# Altium project airbrakeController.PrjPcb
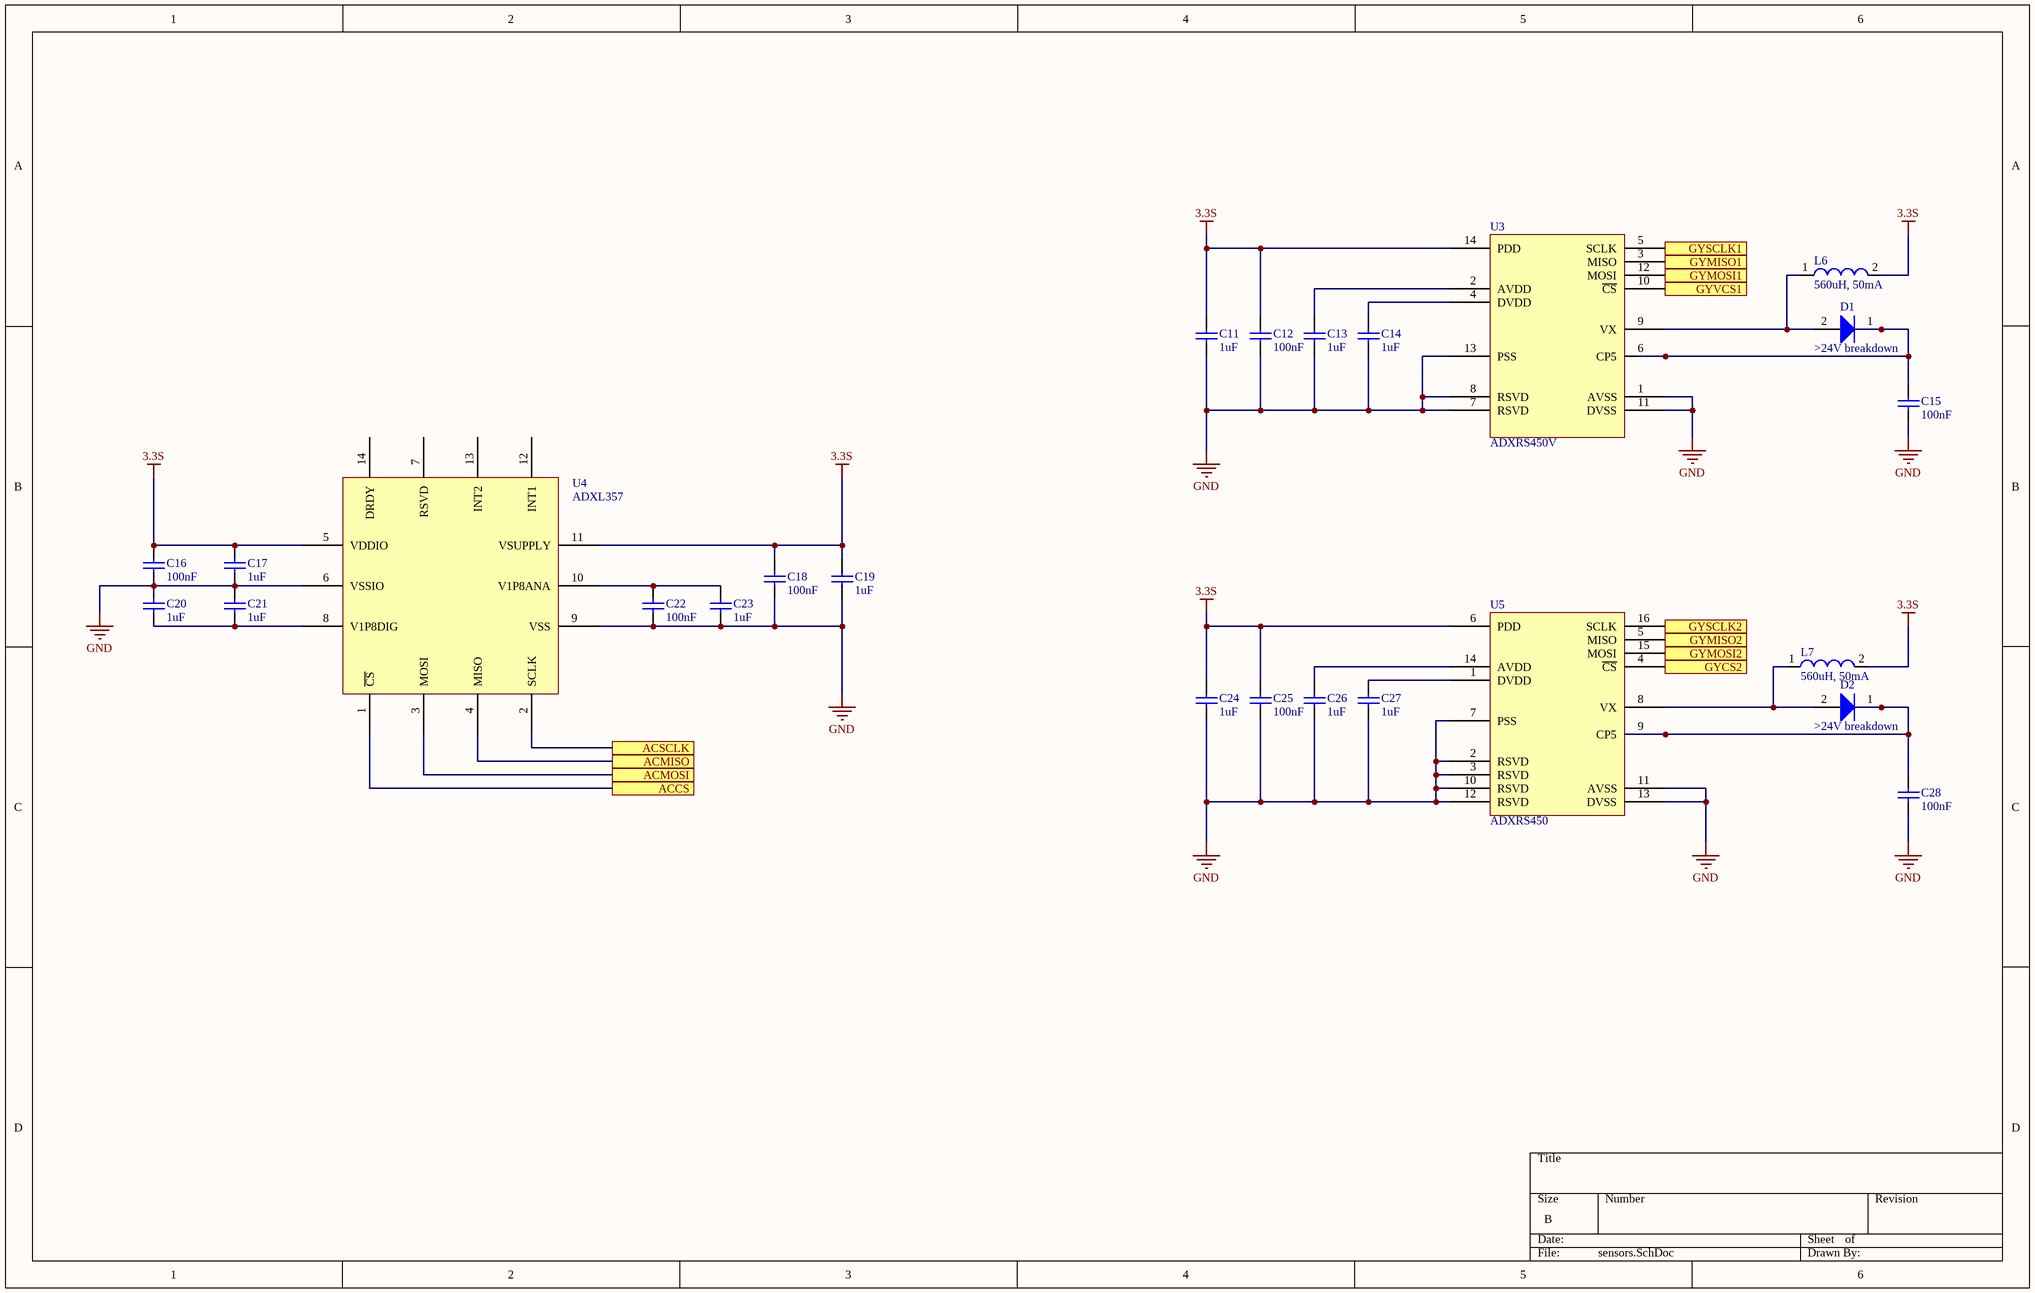
[diagram p0: sensors.SchDoc]
4 sheets, 70 parts. Net scope: flat (ports and power ports of the same name join across sheets).
Sheets:
  sensors.SchDoc
  SAMD21.SchDoc
  SAMD51.SchDoc
  peripherals.SchDoc

## Sheet sensors.SchDoc
size B

### Parts
C11  1uF  [CAPC1709X95X35LL10T25]
C12  100nF  [CAPC1608X90X40ML10T20]
C13  1uF  [CAPC1709X95X35LL10T25]
C14  1uF  [CAPC1709X95X35LL10T25]
C15  100nF  [CAPC1608X90X40ML10T20]
C16  100nF  [CAPC1608X90X40ML10T20]
C17  1uF  [CAPC1709X95X35LL10T25]
C18  100nF  [CAPC1608X90X40ML10T20]
C19  1uF  [CAPC1709X95X35LL10T25]
C20  1uF  [CAPC1709X95X35LL10T25]
C21  1uF  [CAPC1709X95X35LL10T25]
C22  100nF  [CAPC1608X90X40ML10T20]
C23  1uF  [CAPC1709X95X35LL10T25]
C24  1uF  [CAPC1709X95X35LL10T25]
C25  100nF  [CAPC1608X90X40ML10T20]
C26  1uF  [CAPC1709X95X35LL10T25]
C27  1uF  [CAPC1709X95X35LL10T25]
C28  100nF  [CAPC1608X90X40ML10T20]
D1  >24V breakdown  [ONSC-SOD-323-2-477-02_V]
D2  >24V breakdown  [ONSC-SOD-323-2-477-02_V]
L6  560uH, 50mA  [WE-PD-L]
L7  560uH, 50mA  [WE-PD-L]
U3  ADXRS450V  [LCC127P900X400X915-14N]
U4  ADXL357  [LCCS127P605X560X220-14N]
U5  ADXRS450  [SOIC127P1040X373-16N]

### Ports
ACCS, ACMISO, ACMOSI, ACSCLK, GYCS2, GYMISO1, GYMISO2, GYMOSI1, GYMOSI2, GYSCLK1, GYSCLK2, GYVCS1

### Nets
3.3S: C11.2 C12.2 C16.1 C17.2 C18.1 C19.2 C24.2 C25.2 L6.2 L7.2 U3.14(PDD) U4.5(VDDIO) U4.11(VSUPPLY) U5.6(PDD)
GND: C11.1 C12.1 C13.1 C14.1 C15.1 C16.2 C17.1 C18.2 C19.1 C20.2 C21.2 C22.2 C23.1 C24.1 C25.1 C26.1 C27.1 C28.1 U3.1(AVSS) U3.7(RSVD) U3.8(RSVD) U3.11(DVSS) U3.13(PSS) U4.6(VSSIO) U4.9(VSS) U5.2(RSVD) U5.3(RSVD) U5.7(PSS) U5.10(RSVD) U5.11(AVSS) U5.12(RSVD) U5.13(DVSS)
Net*_3: U4.2(SCLK) ; port ACSCLK
Net*_33: U4.3(MOSI) ; port ACMOSI
Net*_34: U4.4(MISO) ; port ACMISO
Net*_40: U5.16(SCLK) ; port GYSCLK2
Net*_41: U3.5(SCLK) ; port GYSCLK1
Net*_47: U3.3(MISO) ; port GYMISO1
Net*_48: U5.5(MISO) ; port GYMISO2
Net*_49: U3.12(MOSI) ; port GYMOSI1
Net*_50: U5.15(MOSI) ; port GYMOSI2
Net*_125: U5.4(~{CS}) ; port GYCS2
Net*_127: U4.1(~{CS}) ; port ACCS
NetC13_2: C13.2 U3.2(AVDD)
NetC14_2: C14.2 U3.4(DVDD)
NetC15_2: C15.2 D1.1(K) U3.6(CP5)
NetC20_1: C20.1 C21.1 U4.8(V1P8DIG)
NetC22_1: C22.1 C23.2 U4.10(V1P8ANA)
NetC26_2: C26.2 U5.14(AVDD)
NetC27_2: C27.2 U5.1(DVDD)
NetC28_2: C28.2 D2.1(K) U5.9(CP5)
NetD1_2: D1.2(A) L6.1 U3.9(VX)
NetD2_2: D2.2(A) L7.1 U5.8(VX)
NetU3_10: U3.10(~{CS}) ; port GYVCS1

Not connected (* = marked no-connect by the designer): U4 7(RSVD) 12(INT1) 13(INT2) 14(DRDY)

### Library data of the parts
C11 C13 C14 C17 C19-C21 C23 C24 C26 C27 = CMP-2000-07531-1: Chip Capacitor, 1 uF, +/- 10%, 50 V, -55 to 125 degC, 0603 (1608 Metric), RoHS, Tape and Reel; Manufacturer: Taiyo Yuden; Voltage Rating: 50V; Dielectric: X7R; Package Reference: 603; Thickness: 0.037inch; Capacitance: 1uF; Width: 0.031inch; Max Operating Temperature: 125degC; Mounting Technology: SurfaceMount; RoHSCompliant: True; Datasheet URL: http://ds.yuden.co.jp/TYCOMPAS/ut/detail.do?productNo=UMK107AB7105KA-T&fileName=UMK107AB7105KA-T_SS&mode=specSheetDownload; Length: 1.6mm; Radiation Hardening: No; Height: 0.8mm; Packaging: TapeandReel; Case/Package: 0603; Mount: SurfaceMount; Halogen Free: HalogenFree; Package Quantity: 1; Package Description: 2-Pin Surface Mount Device, Body 1.65 x 0.85 mm; Manufacturer URL: http://www.t-yuden.com/; Termination: SMD/SMT; Min Operating Temperature: -55degC; Tolerance: 10%; Case Code (Imperial): 0603; Voltage Rating (DC): 50V; Depth: 0.8mm; Datasheet Version: 09/2017; Case Code (Metric): 1608
C12 C15 C16 C18 C22 C25 C28 = CMP-2000-05002-1: Ceramic Multilayer Capacitor, 100 nF, +/- 10%, 50 V, -55 to 155 degC, 0603 (1608 Metric), RoHS, Tape and Reel; Manufacturer: Yageo; Online Catalog: CCSeries; Voltage - Rated: 16V; Product Training Modules: MultilayerCeramicCapacitors; Other Names: 311-1088-6; Featured Product: CommodityMultilayerCeramicCapacitors–CCSeries; Capacitance: 0.1µF; Temperature Coefficient: X7R; Height - Seated (Max): -; Operating Temperature: -55degC~125degC; Package / Case: 0603(1608Metric); Datasheet URL: https://datasheet.ciiva.com/11786/0900766b80d84f1d-11786077.pdf; Package Description: 2-Pin Surface Mount Device, Body 1.6 x 0.8 mm; Family: CeramicCapacitors; Packaging: Digi-Reel; Size / Dimension: 0.063"Lx0.031"W(1.60mmx0.80mm); Thickness (Max): 0.035"(0.90mm); Series: CC; Lead Spacing: -; Features: -; Tolerance: ±10%; Lead Style: -; Ratings: -; Manufacturer URL: http://www.yageo.com/; Package Reference: 603; Standard Package: 1; Category: Capacitors; Mounting Type: SurfaceMount,MLCC; Applications: GeneralPurpose; Datasheet Version: Rev. 2, 05/2009
D1 D2 = CMP-1055-00462-1: Schottky Barrier Diode, 2-Pin SOD-323, Pb-Free, Tape and Reel; PartNumber: BAT54HT1G; Manufacturer: On Semiconductor; Configuration: Single; trr Max (ns): 5; IFSM Max (A): 0.6; ComponentLink3URL: http://www.onsemi.com/pub_link/Collateral/477-02.PDF.1; PackageDescription: 2-Pin SOD, Body 1.7 x 1.25 mm; ComponentLink2URL: http://www.onsemi.cn/pub_link/Collateral/BAT54HT1-D.PDF; ComponentLink3Description: Package Specification; ComponentLink2Description: Datasheet; DatasheetVersion: Rev. 6; PackageReference: SOD-323-2-477-02; RoHS: TRUE; ComponentLink1URL: http://www.onsemi.com/; Packing: Tape and Reel; Mounting Technology: Surface Mount; ComponentLink1Description: Manufacturer URL; PackageVersion: Rev. H, 03/2007
L6 L7 = CMP-0227-00691-1: SMD-Shielded Power Inductor WE-PD, L = 560 µH; Inductance: 560 ÂµH; PackageDescription: SMD Inductor, 2-Leads, Body 12.0 x 12.0 mm; ComponentLink2Description: Datasheet; DatasheetVersion: ver 6, Jun-2005; ComponentLink1Description: Manufacturer Link; PackageVersion: 2006; PackageReference: WE-PD-L; ComponentLink1URL: http://www.we-online.com; ComponentLink2URL: http://www.we-online.de/katalog/media/pdf/74477125.pdf

## Sheet SAMD21.SchDoc
size A
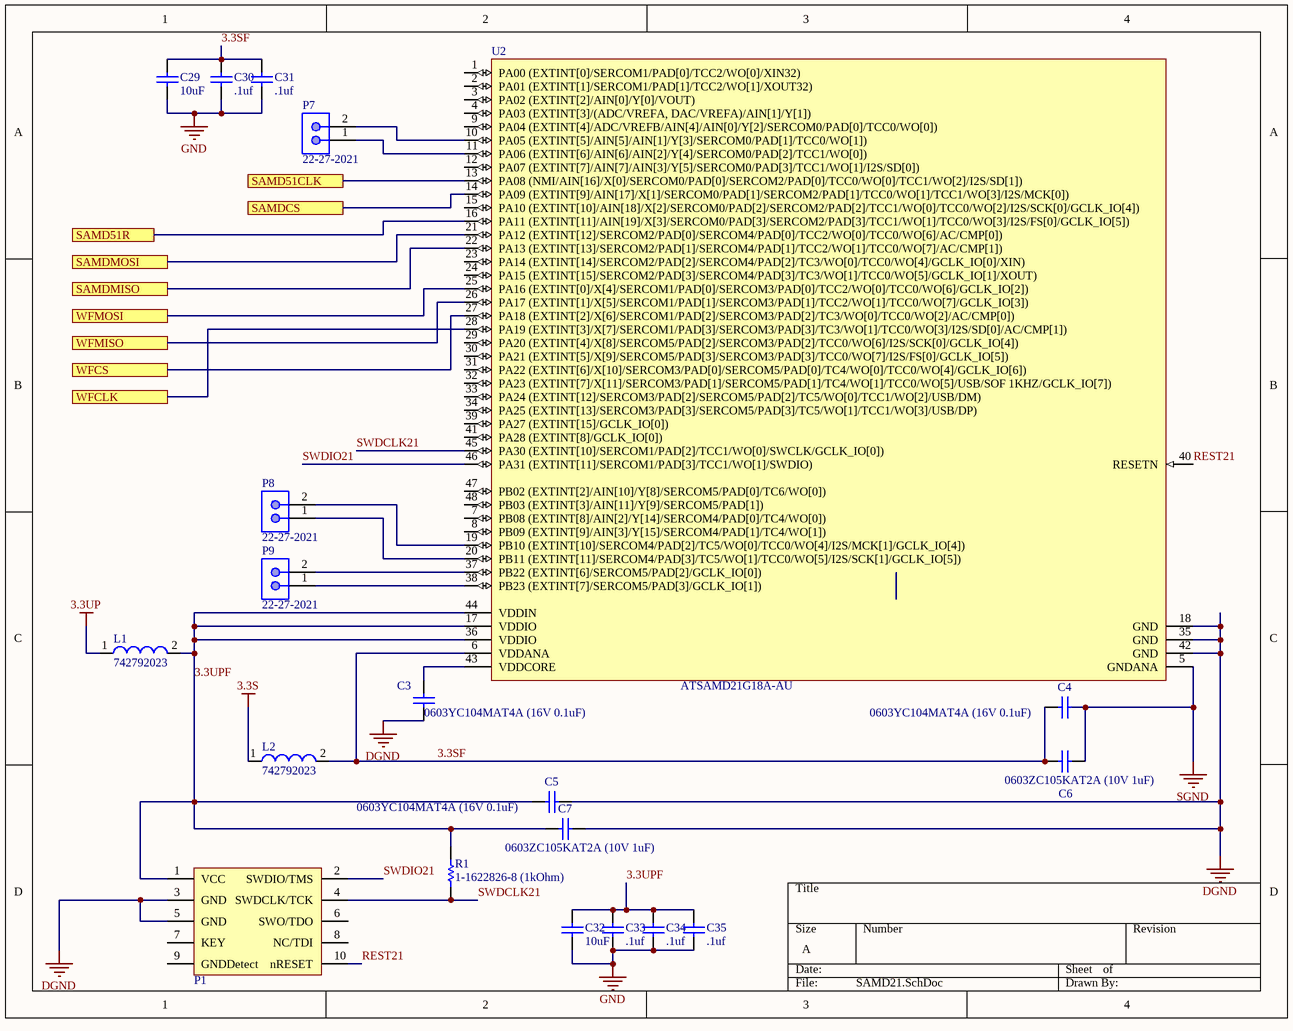
[diagram p1: SAMD21.SchDoc]

### Parts
C3  0603YC104MAT4A (16V 0.1uF)  [CAPC1608X90X35LL15T15]
C4  0603YC104MAT4A (16V 0.1uF)  [CAPC1608X90X35LL15T15]
C5  0603YC104MAT4A (16V 0.1uF)  [CAPC1608X90X35LL15T15]
C6  0603ZC105KAT2A (10V 1uF)  [CAPC1608X90X35LL15T15]
C7  0603ZC105KAT2A (10V 1uF)  [CAPC1608X90X35LL15T15]
C29  10uF  [CAPC1608X90X35NL10T15]
C30  .1uf  [CAPC2013X94X50NL20T25]
C31  .1uf  [CAPC2013X94X50NL20T25]
C32  10uF  [CAPC1608X90X35NL10T15]
C33  .1uf  [CAPC2013X94X50NL20T25]
C34  .1uf  [CAPC2013X94X50NL20T25]
C35  .1uf  [CAPC2013X94X50NL20T25]
L1  742792023  [SMD-0805]
L2  742792023  [SMD-0805]
P1  3220-10-0100-00 Pin connector for Cotex Programmers  (value not drawn)
P7  22-27-2021  [MOLX-22-27-2021_V]
P8  22-27-2021  [MOLX-22-27-2021_V]
P9  22-27-2021  [MOLX-22-27-2021_V]
R1  1-1622826-8 (1kOhm)  [RESC1005X40X25ML10T10]
U2  ATSAMD21G18A-AU  [ATML-TQFP48_M]

### Ports
SAMD51CLK, SAMD51R, SAMDCS, SAMDMISO, SAMDMOSI, WFCLK, WFCS, WFMISO, WFMOSI

### Nets
3.3S: L2.1
3.3UP: L1.1
DGND: C3.2 C5.1 C7.2 P1.3(GND) P1.5(GND) U2.18(GND) U2.35(GND) U2.42(GND)
GND: C29.1 C30.1 C31.1 C32.1 C33.1 C34.1 C35.1
SGND: C4.1 C6.2 U2.5(GNDANA)
3.3SF: C4.2 C6.1 C29.2 C30.2 C31.2 L2.2 U2.6(VDDANA)
3.3UPF: C5.2 C7.1 C32.2 C33.2 C34.2 C35.2 L1.2 P1.1(VCC) R1.2 U2.17(VDDIO) U2.36(VDDIO) U2.44(VDDIN)
REST21: P1.10(nRESET) U2.40(RESETN)
SWDCLK21: P1.4(SWDCLK/TCK) R1.1 U2.45(PA30_(EXTINT[10]/SERCOM1/PAD[2]/TCC1/WO[0]/SWCLK/GCLK_IO[0]))
SWDIO21: P1.2(SWDIO/TMS) U2.46(PA31_(EXTINT[11]/SERCOM1/PAD[3]/TCC1/WO[1]/SWDIO))
WFCLK: U2.28(PA19_(EXTINT[3]/X[7]/SERCOM1/PAD[3]/SERCOM3/PAD[3]/TC3/WO[1]/TCC0/WO[3]/I2S/SD[0]/AC/CMP[1])) ; port WFCLK
WFCS: U2.27(PA18_(EXTINT[2]/X[6]/SERCOM1/PAD[2]/SERCOM3/PAD[2]/TC3/WO[0]/TCC0/WO[2]/AC/CMP[0])) ; port WFCS
WFMISO: U2.26(PA17_(EXTINT[1]/X[5]/SERCOM1/PAD[1]/SERCOM3/PAD[1]/TCC2/WO[1]/TCC0/WO[7]/GCLK_IO[3])) ; port WFMISO
WFMOSI: U2.25(PA16_(EXTINT[0]/X[4]/SERCOM1/PAD[0]/SERCOM3/PAD[0]/TCC2/WO[0]/TCC0/WO[6]/GCLK_IO[2])) ; port WFMOSI
Net*_4: U2.13(PA08_(NMI/AIN[16]/X[0]/SERCOM0/PAD[0]/SERCOM2/PAD[0]/TCC0/WO[0]/TCC1/WO[2]/I2S/SD[1])) ; port SAMD51CLK
Net*_27: U2.16(PA11_(EXTINT[11]/AIN[19]/X[3]/SERCOM0/PAD[3]/SERCOM2/PAD[3]/TCC1/WO[1]/TCC0/WO[3]/I2S/FS[0]/GCLK_IO[5])) ; port SAMD51R
Net*_28: U2.21(PA12_(EXTINT[12]/SERCOM2/PAD[0]/SERCOM4/PAD[0]/TCC2/WO[0]/TCC0/WO[6]/AC/CMP[0])) ; port SAMDMOSI
Net*_29: U2.22(PA13_(EXTINT[13]/SERCOM2/PAD[1]/SERCOM4/PAD[1]/TCC2/WO[1]/TCC0/WO[7]/AC/CMP[1])) ; port SAMDMISO
Net*_30: U2.14(PA09_(EXTINT[9]/AIN[17]/X[1]/SERCOM0/PAD[1]/SERCOM2/PAD[1]/TCC0/WO[1]/TCC1/WO[3]/I2S/MCK[0])) ; port SAMDCS
NetC3_1: C3.1 U2.43(VDDCORE)
NetP7_1: P7.1 U2.11(PA06_(EXTINT[6]/AIN[6]/AIN[2]/Y[4]/SERCOM0/PAD[2]/TCC1/WO[0]))
NetP7_2: P7.2 U2.10(PA05_(EXTINT[5]/AIN[5]/AIN[1]/Y[3]/SERCOM0/PAD[1]/TCC0/WO[1]))
NetP8_1: P8.1 U2.20(PB11_(EXTINT[11]/SERCOM4/PAD[3]/TC5/WO[1]/TCC0/WO[5]/I2S/SCK[1]/GCLK_IO[5]))
NetP8_2: P8.2 U2.19(PB10_(EXTINT[10]/SERCOM4/PAD[2]/TC5/WO[0]/TCC0/WO[4]/I2S/MCK[1]/GCLK_IO[4]))
NetP9_1: P9.1 U2.38(PB23_(EXTINT[7]/SERCOM5/PAD[3]/GCLK_IO[1]))
NetP9_2: P9.2 U2.37(PB22_(EXTINT[6]/SERCOM5/PAD[2]/GCLK_IO[0]))

Not connected (* = marked no-connect by the designer): P1 6(SWO/TDO) 7(KEY) 8(NC/TDI) 9(GNDDetect); U2 1(PA00_(EXTINT[0]/SERCOM1/PAD[0]/TCC2/WO[0]/XIN32)) 2(PA01_(EXTINT[1]/SERCOM1/PAD[1]/TCC2/WO[1]/XOUT32)) 3(PA02_(EXTINT[2]/AIN[0]/Y[0]/VOUT)) 4(PA03_(EXTINT[3]/(ADC/VREFA,_DAC/VREFA)/AIN[1]/Y[1])) 7(PB08_(EXTINT[8]/AIN[2]/Y[14]/SERCOM4/PAD[0]/TC4/WO[0])) 8(PB09_(EXTINT[9]/AIN[3]/Y[15]/SERCOM4/PAD[1]/TC4/WO[1])) 9(PA04_(EXTINT[4]/ADC/VREFB/AIN[4]/AIN[0]/Y[2]/SERCOM0/PAD[0]/TCC0/WO[0])) 12(PA07_(EXTINT[7]/AIN[7]/AIN[3]/Y[5]/SERCOM0/PAD[3]/TCC1/WO[1]/I2S/SD[0])) 15(PA10_(EXTINT[10]/AIN[18]/X[2]/SERCOM0/PAD[2]/SERCOM2/PAD[2]/TCC1/WO[0]/TCC0/WO[2]/I2S/SCK[0]/GCLK_IO[4])) 23(PA14_(EXTINT[14]/SERCOM2/PAD[2]/SERCOM4/PAD[2]/TC3/WO[0]/TCC0/WO[4]/GCLK_IO[0]/XIN)) 24(PA15_(EXTINT[15]/SERCOM2/PAD[3]/SERCOM4/PAD[3]/TC3/WO[1]/TCC0/WO[5]/GCLK_IO[1]/XOUT)) 29(PA20_(EXTINT[4]/X[8]/SERCOM5/PAD[2]/SERCOM3/PAD[2]/TCC0/WO[6]/I2S/SCK[0]/GCLK_IO[4])) 30(PA21_(EXTINT[5]/X[9]/SERCOM5/PAD[3]/SERCOM3/PAD[3]/TCC0/WO[7]/I2S/FS[0]/GCLK_IO[5])) 31(PA22_(EXTINT[6]/X[10]/SERCOM3/PAD[0]/SERCOM5/PAD[0]/TC4/WO[0]/TCC0/WO[4]/GCLK_IO[6])) 32(PA23_(EXTINT[7]/X[11]/SERCOM3/PAD[1]/SERCOM5/PAD[1]/TC4/WO[1]/TCC0/WO[5]/USB/SOF_1KHZ/GCLK_IO[7])) 33(PA24_(EXTINT[12]/SERCOM3/PAD[2]/SERCOM5/PAD[2]/TC5/WO[0]/TCC1/WO[2]/USB/DM)) 34(PA25_(EXTINT[13]/SERCOM3/PAD[3]/SERCOM5/PAD[3]/TC5/WO[1]/TCC1/WO[3]/USB/DP)) 39(PA27_(EXTINT[15]/GCLK_IO[0])) 41(PA28_(EXTINT[8]/GCLK_IO[0])) 47(PB02_(EXTINT[2]/AIN[10]/Y[8]/SERCOM5/PAD[0]/TC6/WO[0])) 48(PB03_(EXTINT[3]/AIN[11]/Y[9]/SERCOM5/PAD[1]))

### Library data of the parts
C3-C5 = CMP-2006-02126-1: Manufacturer: AVX Interconnect / Elco; Part Number: 0603YC104MAT4A
C6 C7 = CMP-2006-04551-1: Manufacturer: AVX Interconnect / Elco; Part Number: 0603ZC105KAT2A
C29 C32 = CMP-2006-02792-1: Part Number: GRM188R60J106ME47D; Manufacturer: Murata
C30 C31 C33-C35 = CMP-2007-04454-1: Part Number: 0805YC104KAT2A; Manufacturer: AVX Interconnect / Elco
L1 L2 = CMP-0220-00030-1: SMD EMI Suppression Ferrite Bead WE-CBF, Z = 120 Ohm; Impedance: 120 Ohm; PackageDescription: Chip Inductor, 2-Leads, Body 2.0 x 1.2 mm; ComponentLink2URL: http://www.we-online.de/katalog/media/pdf/742792023.pdf; ComponentLink1Description: Manufacturer Link; ComponentLink2Description: Datasheet; DatasheetVersion: Dec-2005; PackageReference: SMD-0805; ComponentLink1URL: http://www.we-online.com; PackageVersion: 2005
P1 = 3220-10-0100-00: 3220-10-0100-00 Pin connector from DigiKey; ComponentLink1Description: 3220-10-0100-00; ComponentLink1URL: https://www.digikey.com/product-detail/en/cnc-tech/3220-10-0100-00/1175-1627-ND/3883661
P7-P9 = CMP-2000-05537-1: Male Header, Pitch 2.54 mm, 1 x 2 Position, Height 11.7 mm, Tail Length 3.56 mm, 0 to 75 degC, RoHS, Bulk; Manufacturer: Molex; PartNumber: 0022272021; Current rating: 4A; Package Version: Rev. BC, 02/2012; Voltage rating: 250V; No. of Positions: 2; Pitch: 2.54mm; No. of Rows: 1; Orientation: Vertical; Operating temperature: 0°Cto+75°C; Manufacturer URL: http://www.molex.com/; Mounting Technology: ThroughHole; Housing material: Nylon(UL94V-0); Package Description: 2-Leads Header, Body 5.08 x 5.8 mm, Pitch 2.54 mm; Voltage - Max: 250V; Datasheet URL: http://www.molex.com/pdm_docs/sd/022272021_sd.pdf; Package Reference: 22-27-2021; Contact material: Tinplatedbrass; Current - Max: 4A; Datasheet Version: Rev. F, 06/2009
R1 = CMP-2002-04643-1: Manufacturer: TE Connectivity / AMP; Part Number: 1-1622826-8
U2 = CMP-2100-03585-1: SMART ARM-Based Microcontroller, 1.62 to 3.63 V, 256 KB Flash, 32 KB SRAM, -40 to 85 degC, 48-Pin TQFP, RoHS, Tray; Manufacturer: Atmel; Max Frequency: 48MHz; Number of Timers/Counters: 6; Max Supply Voltage: 3.63V; Min Supply Voltage: 1.62V; Packaging: Tray; Datasheet Version: Rev. N, 10/2016; Datasheet URL: http://www.atmel.com/images/atmel-42181-sam-d21_datasheet.pdf; REACH SVHC: NoSVHC; RoHSCompliant: true; Max Operating Temperature: 85degC; Manufacturer URL: http://www.atmel.com/; Contact Plating: Tin; Frequency: 48MHz; Package Description: 48-Pin Thin Profile Plastic Quad Flat Package, Body 7 x 7 mm, Pitch 0.5 mm; Package Reference: TQFP48; Lead Free: LeadFree; Number of Pins: 48; Min Operating Temperature: -40degC; Case/Package: TQFP; Mount: SurfaceMount

## Sheet SAMD51.SchDoc
size A4
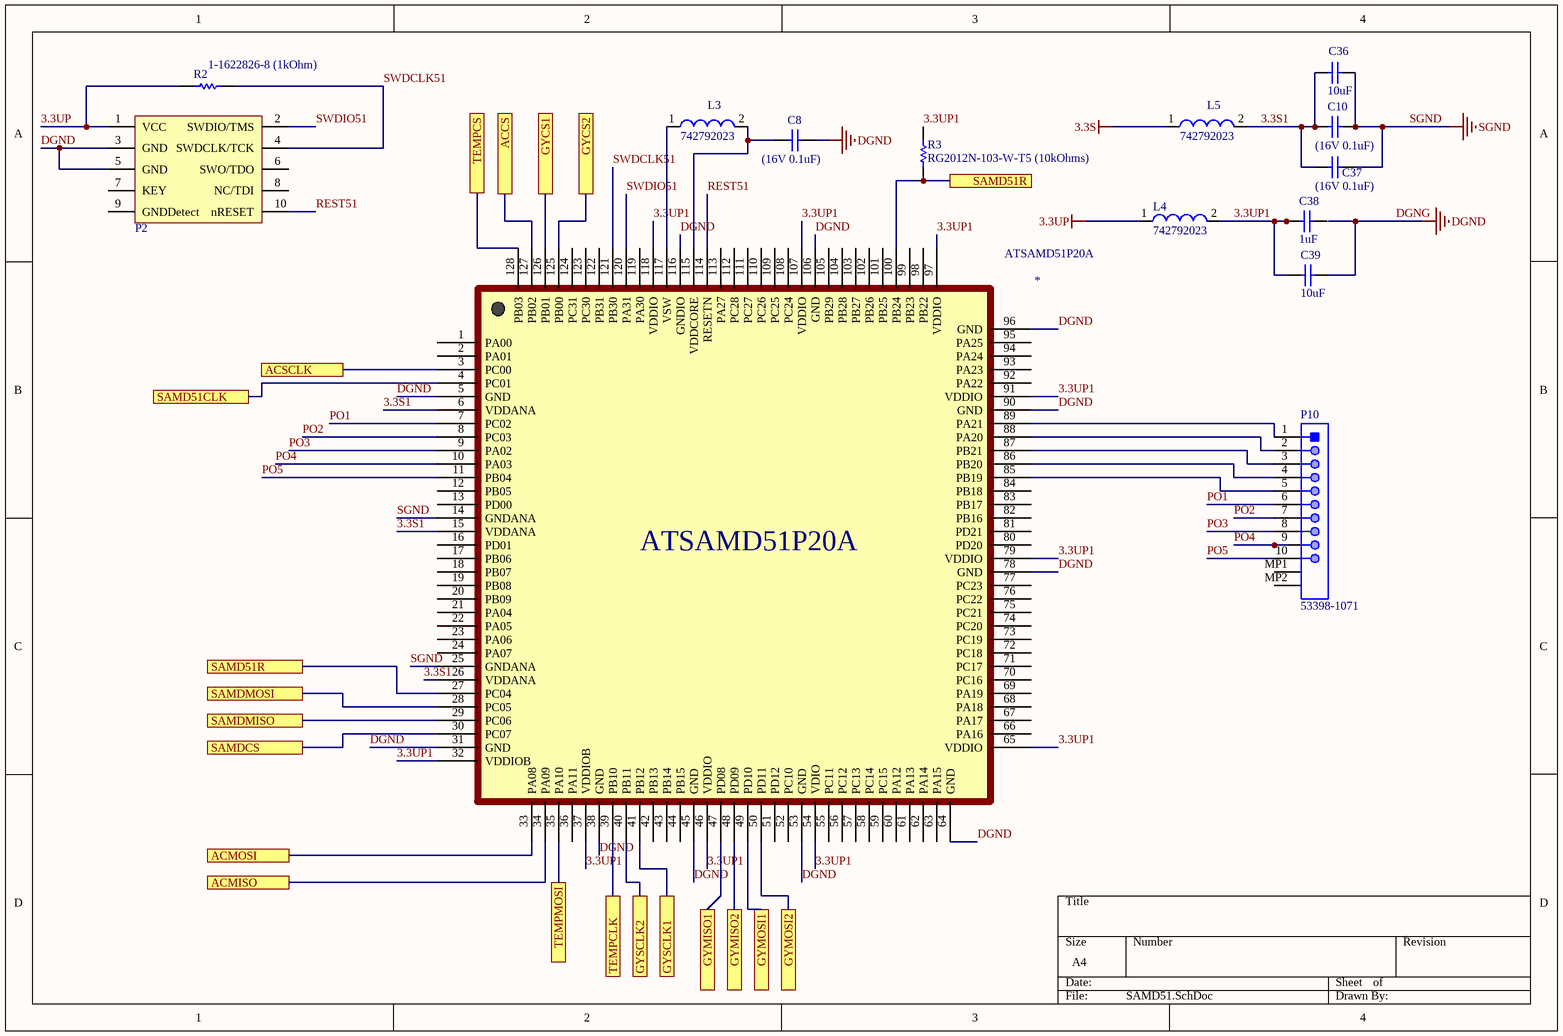
[diagram p2: SAMD51.SchDoc]

### Parts
*  ATSAMD51P20A  [ATSAMD51P20A]
C8  (16V 0.1uF)  [CAPC1608X90X35LL15T15]
C10  (16V 0.1uF)  [CAPC1608X90X35LL15T15]
C36  10uF  [CAPC1608X90X35NL10T15]
C37  (16V 0.1uF)  [CAPC1608X90X35LL15T15]
C38  1uF  [CAPC1608X90X35LL15T15]
C39  10uF  [CAPC1608X90X35NL10T15]
L3  742792023  [SMD-0805]
L4  742792023  [SMD-0805]
L5  742792023  [SMD-0805]
P2  3220-10-0100-00 Pin connector for Cotex Programmers  (value not drawn)
P10  53398-1071  [MOLX-53398-1071_V]
R2  1-1622826-8 (1kOhm)  [RESC1005X40X25ML10T10]
R3  RG2012N-103-W-T5 (10kOhms)  [RESC2013X50X40NL20T20]

### Ports
ACCS, ACMISO, ACMOSI, ACSCLK, GYCS1, GYCS2, GYMISO1, GYMISO2, GYMOSI1, GYMOSI2, GYSCLK1, GYSCLK2, SAMD51CLK, SAMD51R, SAMDCS, SAMDMISO, SAMDMOSI, TEMPCLK, TEMPCS, TEMPMOSI

### Nets
3.3S: L5.1
3.3UP: L4.1 P2.1(VCC) R2.2
DGND: *.5(GND) *.31(GND) *.38(GND) *.45(GND) *.53(GND) *.64(GND) *.78(GND) *.90(GND) *.96(GND) *.106(GND) *.116(GNDIO) C8.2 C39.1 P2.3(GND) P2.5(GND)  [also labelled DGNG]
SGND: *.14(GNDANA) *.25(GNDANA) C10.2 C36.1 C37.2
3.3S1: *.6(VDDANA) *.15(VDDANA) *.26(VDDANA) C10.1 C36.2 C37.1 L5.2
3.3UP1: *.32(VDDIOB) *.37(VDDIOB) *.46(VDDIO) *.54(VDIO) *.65(VDDIO) *.79(VDDIO) *.91(VDDIO) *.97(VDDIO) *.107(VDDIO) *.118(VDDIO) C38.2 C39.2 L4.2 R3.2
PO1: *.7(PC02) P10.6
PO2: *.8(PC03) P10.7
PO3: *.9(PA02) P10.8
PO4: *.10(PA03) P10.9
PO5: *.11(PB04) P10.10
REST51: *.114(RESETN) P2.10(nRESET)
SWDCLK51: *.121(PB30) P2.4(SWDCLK/TCK) R2.1
SWDIO51: *.120(PA31) P2.2(SWDIO/TMS)
Net*_3: *.3(PC00) ; port ACSCLK
Net*_4: *.4(PC01) ; port SAMD51CLK
Net*_27: *.27(PC04) *.100(PB24) R3.1 ; port SAMD51R
Net*_28: *.28(PC05) ; port SAMDMOSI
Net*_29: *.29(PC06) ; port SAMDMISO
Net*_30: *.30(PC07) ; port SAMDCS
Net*_33: *.33(PA08) ; port ACMOSI
Net*_34: *.34(PA09) ; port ACMISO
Net*_35: *.35(PA10) ; port TEMPMOSI
Net*_39: *.39(PB10) ; port TEMPCLK
Net*_40: *.40(PB11) ; port GYSCLK2
Net*_41: *.41(PB12) ; port GYSCLK1
Net*_47: *.47(PD08) ; port GYMISO1
Net*_48: *.48(PD09) ; port GYMISO2
Net*_49: *.49(PD10) ; port GYMOSI1
Net*_50: *.50(PD11) ; port GYMOSI2
Net*_85: *.85(PB19) P10.5
Net*_86: *.86(PB20) P10.4
Net*_87: *.87(PB21) P10.3
Net*_88: *.88(PA20) P10.2
Net*_89: *.89(PA21) P10.1
Net*_115: *.115(VDDCORE) C8.1 L3.2
Net*_117: *.117(VSW) L3.1
Net*_125: *.125(PB00) ; port GYCS2
Net*_126: *.126(PB01) ; port GYCS1
Net*_127: *.127(PB02) ; port ACCS
Net*_128: *.128(PB03) ; port TEMPCS

Not connected (* = marked no-connect by the designer): * 1(PA00) 2(PA01) 12(PB05) 13(PD00) 16(PD01) 17(PB06) 18(PB07) 19(PB08) 20(PB09) 21(PA04) 22(PA05) 23(PA06) 24(PA07) 36(PA11) 42(PB13) 43(PB14) 44(PB15) 51(PD12) 52(PC10) 55(PC11) 56(PC12) 57(PC13) 58(PC14) 59(PC15) 60(PA12) 61(PA13) 62(PA14) 63(PA15) 66(PA16) 67(PA17) 68(PA18) 69(PA19) 70(PC16) 71(PC17) 72(PC18) 73(PC19) 74(PC20) 75(PC21) 76(PC22) 77(PC23) 80(PD20) 81(PD21) 82(PB16) 83(PB17) 84(PB18) 92(PA22) 93(PA23) 94(PA24) 95(PA25) 98(PB22) 99(PB23) 101(PB25) 102(PB26) 103(PB27) 104(PB28) 105(PB29) 108(PC24) 109(PC25) 110(PC26) 111(PC27) 112(PC28) 113(PA27) 119(PA30) 122(PB31) 123(PC30) 124(PC31); C38 1; P2 6(SWO/TDO) 7(KEY) 8(NC/TDI) 9(GNDDetect); P10 MP1 MP2

### Library data of the parts
* = ATSAMD51P20A: https://www.microchip.com/wwwproducts/en/ATSAMD51P20A#additional-features; ComponentLink1Description: ATSAMD51P20A; ComponentLink1URL: https://www.microchip.com/wwwproducts/en/ATSAMD51P20A#additional-features
C8 C10 C37 = CMP-2006-02126-1: Part Number: 0603YC104MAT4A; Manufacturer: AVX Interconnect / Elco
C36 C39 = CMP-2006-02792-1: as C29 on sheet SAMD21
C38 = CMP-2006-04551-1: Part Number: 0603ZC105KAT2A; Manufacturer: AVX Interconnect / Elco
L3-L5 = CMP-0220-00030-1: as L1 on sheet SAMD21; PackageDescription: Chip Inductor, 2-Leads, Body 2.0 x 1.2 mm; ComponentLink2URL: http://www.we-online.de/katalog/media/pdf/742792023.pdf; ComponentLink1Description: Manufacturer Link; ComponentLink2Description: Datasheet; DatasheetVersion: Dec-2005; PackageReference: SMD-0805; ComponentLink1URL: http://www.we-online.com; PackageVersion: 2005
P2 = 3220-10-0100-00: as P1 on sheet SAMD21; ComponentLink1Description: 3220-10-0100-00; ComponentLink1URL: https://www.digikey.com/product-detail/en/cnc-tech/3220-10-0100-00/1175-1627-ND/3883661
P10 = CMP-2000-05635-1: Male Header, Pitch 1.25 mm, 1 x 10 Position, Height 4.7 mm, -40 to 85 degC, RoHS, Tape and Reel; Manufacturer: Molex; Mounting Angle: Vertical; Pitch: 1.25mm; Voltage Rating: 125V; Current Rating: 1A; Number of Rows: 1Row; Housing Material: Nylon; Mounting Technology: SurfaceMount; Mounting Style: SMD; Contact Material: PhosphorBronze; Product: Headers; Datasheet URL: http://www.molex.com/pdm_docs/sd/533981071_sd.pdf; Manufacturer URL: http://www.molex.com/; Datasheet Version: Rev. J, 09/2015; Factory Pack Quantity: 1000; Brand: Molex; Packaging: Reel; Product Category: Headers&WireHousings; Contact Gender: Pin(Male); Number of Positions: 10Position; RoHS: Details; Contact Plating: Tin; Package Description: Male Header, Pitch 1.25 mm, 1 x 10 Position, Height 4.7 mm; Series: 53398; Type: Shrouded; Package Reference: 53398-1071; Tradename: PicoBlade; Termination Style: SMD
R2 = CMP-2002-04643-1: Manufacturer: TE Connectivity / AMP; Part Number: 1-1622826-8
R3 = CMP-2001-04803-1: Manufacturer: Susumu; Part Number: RG2012N-103-W-T5

## Sheet peripherals.SchDoc
size Legal
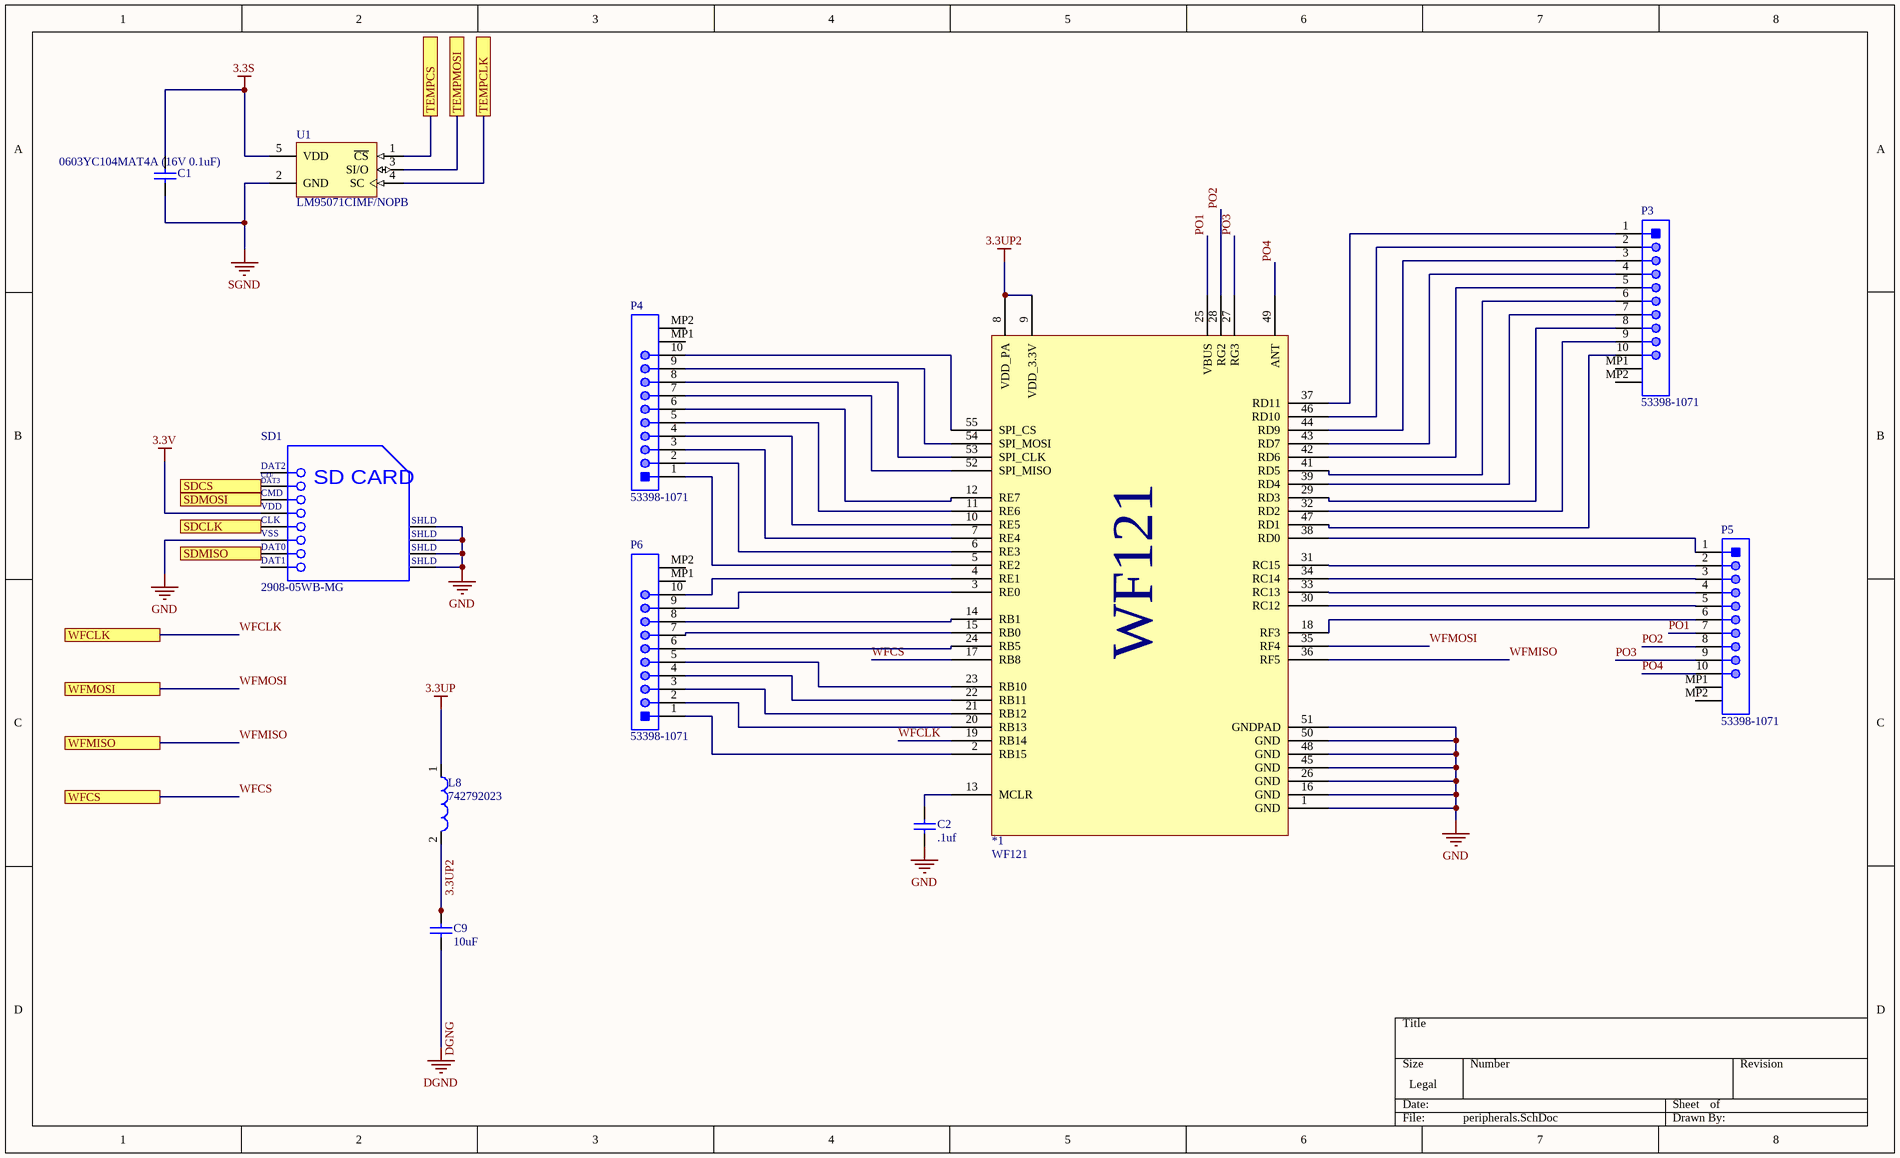
[diagram p3: peripherals.SchDoc]

### Parts
*1  WF121  [WF121]
C1  0603YC104MAT4A (16V 0.1uF)  [CAPC1608X90X35LL15T15]
C2  .1uf  [CAPC2013X94X50NL20T25]
C9  10uF  [CAPC1608X90X35NL10T15]
L8  742792023  [SMD-0805]
P3  53398-1071  [MOLX-53398-1071_V]
P4  53398-1071  [MOLX-53398-1071_V]
P5  53398-1071  [MOLX-53398-1071_V]
P6  53398-1071  [MOLX-53398-1071_V]
SD1  2908-05WB-MG  [3M-2908-05WB-MG_V]
U1  LM95071CIMF/NOPB  [DBV0005A_L]

### Ports
SDCLK, SDCS, SDMISO, SDMOSI, TEMPCLK, TEMPCS, TEMPMOSI, WFCLK, WFCS, WFMISO, WFMOSI

### Nets
3.3S: C1.2 U1.5(VDD)
3.3UP: L8.1
3.3UP2: *1.8(VDD_PA) *1.9(VDD_3.3V) C9.2 L8.2
3.3V: SD1.4(VDD)
DGND: C9.1  [also labelled DGNG]
GND: *1.1(GND) *1.16(GND) *1.26(GND) *1.45(GND) *1.48(GND) *1.50(GND) *1.51(GNDPAD) C2.1 SD1.6(VSS) SD1.9(SHLD) SD1.10(SHLD) SD1.11(SHLD) SD1.12(SHLD)
SGND: C1.1 U1.2(GND)
PO1: *1.25(VBUS) P5.7
PO2: *1.28(RG2) P5.8
PO3: *1.27(RG3) P5.9
PO4: *1.49(ANT) P5.10
WFCLK: *1.19(RB14) ; port WFCLK
WFCS: *1.17(RB8) ; port WFCS
WFMISO: *1.36(RF5) ; port WFMISO
WFMOSI: *1.35(RF4) ; port WFMOSI
Net*1_2: *1.2(RB15) P6.1
Net*1_3: *1.3(RE0) P6.9
Net*1_4: *1.4(RE1) P6.10
Net*1_5: *1.5(RE2) P4.1
Net*1_6: *1.6(RE3) P4.2
Net*1_7: *1.7(RE4) P4.3
Net*1_10: *1.10(RE5) P4.4
Net*1_11: *1.11(RE6) P4.5
Net*1_12: *1.12(RE7) P4.6
Net*1_13: *1.13(MCLR) C2.2
Net*1_14: *1.14(RB1) P6.8
Net*1_15: *1.15(RB0) P6.7
Net*1_18: *1.18(RF3) P5.6
Net*1_20: *1.20(RB13) P6.2
Net*1_21: *1.21(RB12) P6.3
Net*1_22: *1.22(RB11) P6.4
Net*1_23: *1.23(RB10) P6.5
Net*1_24: *1.24(RB5) P6.6
Net*1_29: *1.29(RD3) P3.8
Net*1_30: *1.30(RC12) P5.5
Net*1_31: *1.31(RC15) P5.2
Net*1_32: *1.32(RD2) P3.9
Net*1_33: *1.33(RC13) P5.4
Net*1_34: *1.34(RC14) P5.3
Net*1_37: *1.37(RD11) P3.1
Net*1_38: *1.38(RD0) P5.1
Net*1_39: *1.39(RD4) P3.7
Net*1_41: *1.41(RD5) P3.6
Net*1_42: *1.42(RD6) P3.5
Net*1_43: *1.43(RD7) P3.4
Net*1_44: *1.44(RD9) P3.3
Net*1_46: *1.46(RD10) P3.2
Net*1_47: *1.47(RD1) P3.10
Net*1_52: *1.52(SPI_MISO) P4.7
Net*1_53: *1.53(SPI_CLK) P4.8
Net*1_54: *1.54(SPI_MOSI) P4.9
Net*1_55: *1.55(SPI_CS) P4.10
Net*_35: U1.3(SI/O) ; port TEMPMOSI
Net*_39: U1.4(SC) ; port TEMPCLK
Net*_128: U1.1(~{CS}) ; port TEMPCS
NetSD1_2: SD1.2(CD/DAT3) ; port SDCS
NetSD1_3: SD1.3(CMD) ; port SDMOSI
NetSD1_5: SD1.5(CLK) ; port SDCLK
NetSD1_7: SD1.7(DAT0) ; port SDMISO

Not connected (* = marked no-connect by the designer): P3 MP1 MP2; P4 MP1 MP2; P5 MP1 MP2; P6 MP1 MP2; SD1 1(DAT2) 8(DAT1)

### Notes on the sheet
- (in symbol CMP-2000-05030-1) CD/; DAT3; SD CARD

### Library data of the parts
*1 = WF121: WF121 WIFI Module.; ComponentLink1Description: Datasheet; ComponentLink1URL: https://www.silabs.com/documents/public/data-sheets/WF121-DataSheet.pdf
C1 = CMP-2006-02126-1: Manufacturer: AVX Interconnect / Elco; Part Number: 0603YC104MAT4A
C2 = CMP-2007-04454-1: as C30 on sheet SAMD21
C9 = CMP-2006-02792-1: as C29 on sheet SAMD21
L8 = CMP-0220-00030-1: as L1 on sheet SAMD21; PackageDescription: Chip Inductor, 2-Leads, Body 2.0 x 1.2 mm; ComponentLink2URL: http://www.we-online.de/katalog/media/pdf/742792023.pdf; ComponentLink1Description: Manufacturer Link; ComponentLink2Description: Datasheet; DatasheetVersion: Dec-2005; PackageReference: SMD-0805; ComponentLink1URL: http://www.we-online.com; PackageVersion: 2005
P3-P6 = CMP-2000-05635-1: as P10 on sheet SAMD51; Number of Rows: 1Row; Housing Material: Nylon; Mounting Technology: SurfaceMount; Mounting Style: SMD; Contact Material: PhosphorBronze; Product: Headers; Datasheet URL: http://www.molex.com/pdm_docs/sd/533981071_sd.pdf; Manufacturer URL: http://www.molex.com/; Datasheet Version: Rev. J, 09/2015; Factory Pack Quantity: 1000; Brand: Molex; Packaging: Reel; Product Category: Headers&WireHousings; Contact Gender: Pin(Male); Number of Positions: 10Position; RoHS: Details; Contact Plating: Tin; Package Description: Male Header, Pitch 1.25 mm, 1 x 10 Position, Height 4.7 mm; Series: 53398; Type: Shrouded; Package Reference: 53398-1071; Tradename: PicoBlade; Termination Style: SMD
SD1 = CMP-2000-05030-1: Card Connector Micro-SD, 500 VAC, 100 mOhm Min, 0.5 A, RoHS, Tape and Reel; Manufacturer: 3M; Connector Type: ConnectorandEjector; Other Related Documents: SDCardDateCodeDecipher; Insertion, Removal Method: PushIn,PushOut; Other Names: 3M5607CT; PCN Obsolescence/ EOL: 2908Series30/Jun/2010; Number of Positions: 10(8+2); Card Type: SecureDigital-microSD™; Online Catalog: 2900Series; Featured Product: 3MCardConnectormicroSD; Features: Switch; Packaging: CutTape(CT); Package Reference: 2908-05WB-MG; Package Description: 8-Pin Surface Mount Device, Body 15.2 x 14 mm, Pitch 1.1 mm; Contact Finish: Gold; Catalog Drawings: 2908-05WB-MG; Mounting Feature: Normal,Standard-Top; Series: 2900; Datasheet Version: Oct-06; Datasheet URL: http://datasheet.octopart.com/2908-05WB-MG-3M-datasheet-6398107.pdf; Contact Finish Thickness: 15µin(0.38µm); Manufacturer URL: http://www.3m.com/; Family: MemoryConnectors-PCCardSockets; Category: Connectors,Interconnects; Standard Package: 1; Mounting Type: SurfaceMount,RightAngle; Ejector Side: -; Height Above Board: 0.073"(1.85mm)
U1 = CMP-0066-00211-3: SPI/MICROWIRE 13-Bit Plus Sign Temperature Sensor, 5-pin SOT-23, Pb-Free; Manufacturer: Texas Instruments; CompType: Temp Sensor IC; PackageTopMarking: T18C*XTT; PowerWise: Y; PackageDescription: Molded SOT-23, .115 x .063 x .040 in Body, 5 Lead, .0375 in Pitch; ComponentLink1URL: http://www.ti.com/general/docs/lit/getliterature.tsp?genericPartNumber=LM95071&fileType=pdf; ComponentLink1Description: Datasheet URL; PinCount: 5; RoHS: Y; PackageReference: DBV0005A

## Nets that join several sheets
3.3S: sensors (14 pins), SAMD21 (L2.1), SAMD51 (L5.1), peripherals (C1.2 U1.5)
3.3UP: SAMD21 (L1.1), SAMD51 (L4.1 P2.1 R2.2), peripherals (L8.1)
DGND: SAMD21 (8 pins), SAMD51 (15 pins), peripherals (C9.1)
GND: sensors (32 pins), SAMD21 (7 pins), peripherals (13 pins)
SGND: SAMD21 (C4.1 C6.2 U2.5), SAMD51 (5 pins), peripherals (C1.1 U1.2)
Net*_3: sensors (U4.2), SAMD51 (*.3)
Net*_4: SAMD21 (U2.13), SAMD51 (*.4)
Net*_27: SAMD21 (U2.16), SAMD51 (*.27 *.100 R3.1)
Net*_28: SAMD21 (U2.21), SAMD51 (*.28)
Net*_29: SAMD21 (U2.22), SAMD51 (*.29)
Net*_30: SAMD21 (U2.14), SAMD51 (*.30)
Net*_33: sensors (U4.3), SAMD51 (*.33)
Net*_34: sensors (U4.4), SAMD51 (*.34)
Net*_35: SAMD51 (*.35), peripherals (U1.3)
Net*_39: SAMD51 (*.39), peripherals (U1.4)
Net*_40: sensors (U5.16), SAMD51 (*.40)
Net*_41: sensors (U3.5), SAMD51 (*.41)
Net*_47: sensors (U3.3), SAMD51 (*.47)
Net*_48: sensors (U5.5), SAMD51 (*.48)
Net*_49: sensors (U3.12), SAMD51 (*.49)
Net*_50: sensors (U5.15), SAMD51 (*.50)
Net*_125: sensors (U5.4), SAMD51 (*.125)
Net*_127: sensors (U4.1), SAMD51 (*.127)
Net*_128: SAMD51 (*.128), peripherals (U1.1)
WFCLK: SAMD21 (U2.28), peripherals (*1.19)
WFCS: SAMD21 (U2.27), peripherals (*1.17)
WFMISO: SAMD21 (U2.26), peripherals (*1.36)
WFMOSI: SAMD21 (U2.25), peripherals (*1.35)